# Altium schematic sheet BMS_DAISYCHAIN.SchDoc
size B; Organization: Altium Limited; Address1: L3, 12a Rodborough Rd; Address2: Frenchs Forest; Address3: NSW; Address4: Australia 2086
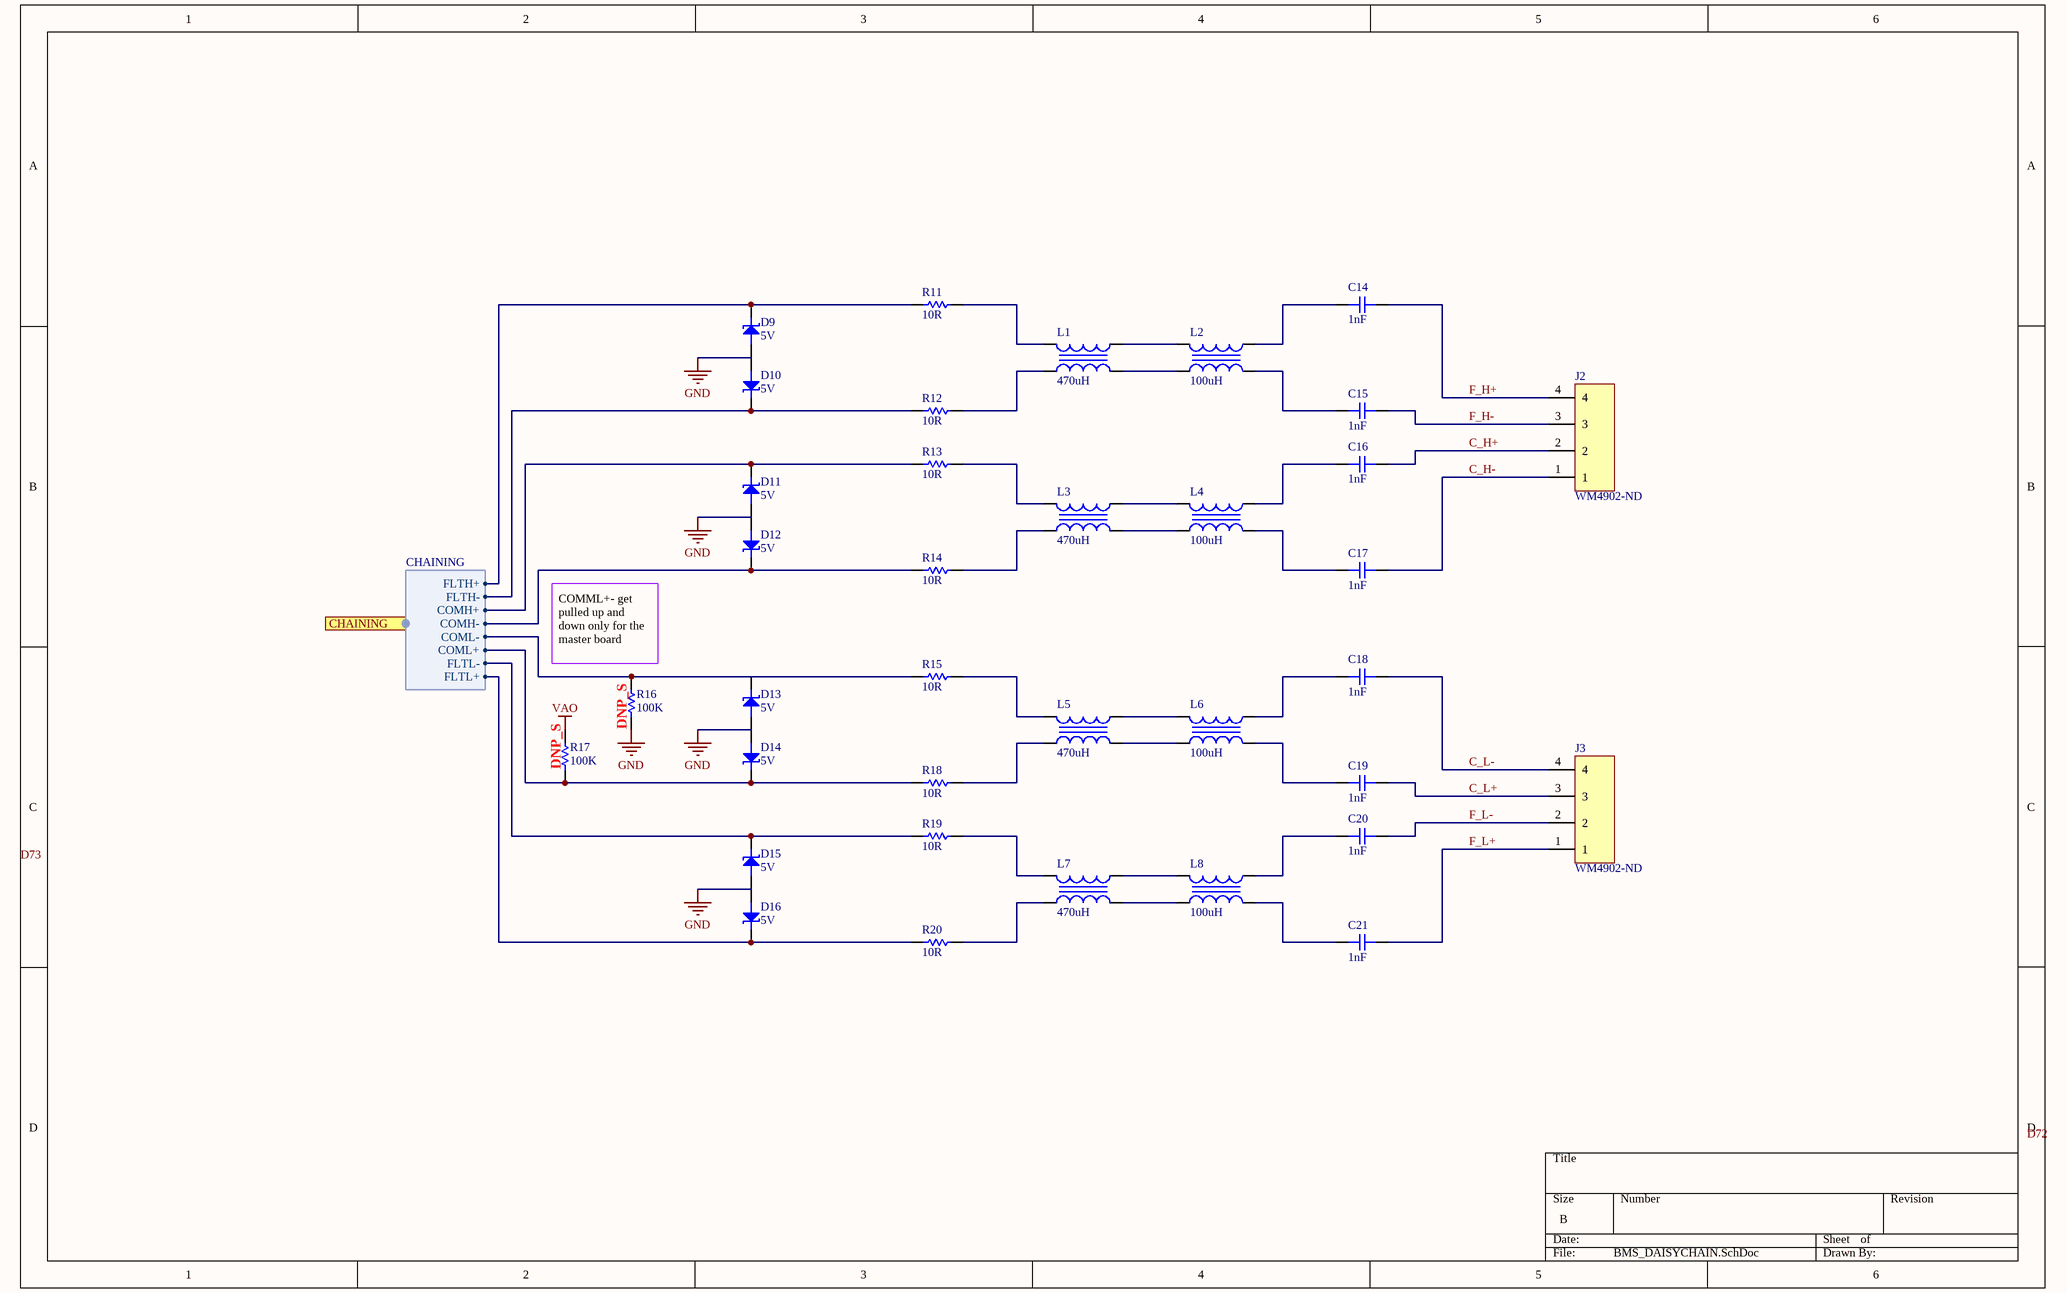
[diagram p0: BMS_DAISYCHAIN.SchDoc]

## Parts
C14  1nF  [CAP-0603]
C15  1nF  [CAP-0603]
C16  1nF  [CAP-0603]
C17  1nF  [CAP-0603]
C18  1nF  [CAP-0603]
C19  1nF  [CAP-0603]
C20  1nF  [CAP-0603]
C21  1nF  [CAP-0603]
D9  5V  [DIODE-SOD323]
D10  5V  [DIODE-SOD323]
D11  5V  [DIODE-SOD323]
D12  5V  [DIODE-SOD323]
D13  5V  [DIODE-SOD323]
D14  5V  [DIODE-SOD323]
D15  5V  [DIODE-SOD323]
D16  5V  [DIODE-SOD323]
J2  WM4902-ND  [4PIN]
J3  WM4902-ND  [4PIN]
L1  470uH  [CMC470u]
L2  100uH  [CMC100U]
L3  470uH  [CMC470u]
L4  100uH  [CMC100U]
L5  470uH  [CMC470u]
L6  100uH  [CMC100U]
L7  470uH  [CMC470u]
L8  100uH  [CMC100U]
R11  10R  [RES-0603]
R12  10R  [RES-0603]
R13  10R  [RES-0603]
R14  10R  [RES-0603]
R15  10R  [RES-0603]
R16  100K  [RES-0603]
R17  100K  [RES-0603]
R18  10R  [RES-0603]
R19  10R  [RES-0603]
R20  10R  [RES-0603]

## Ports
CHAINING (harness CHAINING)

## Harnesses
CHAINING: FLTH+, FLTH-, COMH+, COMH-, COML-, COML+, FLTL-, FLTL+

## Nets
GND: D9.2 D10.2 D11.2 D12.2 D13.2 D14.2 D15.2 D16.2 R16.1
VAO: R17.2
C_H+: C16.2 J2.2
C_H-: C17.2 J2.1
C_L+: C19.2 J3.3
C_L-: C18.2 J3.4
F_H+: C14.2 J2.4
F_H-: C15.2 J2.3
F_L+: C21.2 J3.1
F_L-: C20.2 J3.2
NetC14_1: C14.1 L2.4
NetC15_1: C15.1 L2.3
NetC16_1: C16.1 L4.4
NetC17_1: C17.1 L4.3
NetC18_1: C18.1 L6.4
NetC19_1: C19.1 L6.3
NetC20_1: C20.1 L8.4
NetC21_1: C21.1 L8.3
NetD9_1: D9.1 R11.1 ; port CHAINING.FLTH+
NetD10_1: D10.1 R12.1 ; port CHAINING.FLTH-
NetD11_1: D11.1 R13.1 ; port CHAINING.COMH+
NetD12_1: D12.1 R14.1 ; port CHAINING.COMH-
NetD13_1: D13.1 R15.1 R16.2 ; port CHAINING.COML-
NetD14_1: D14.1 R17.1 R18.1 ; port CHAINING.COML+
NetD15_1: D15.1 R19.1 ; port CHAINING.FLTL-
NetD16_1: D16.1 R20.1 ; port CHAINING.FLTL+
NetL1_1: L1.1 R11.2
NetL1_2: L1.2 R12.2
NetL1_3: L1.3 L2.2
NetL1_4: L1.4 L2.1
NetL3_1: L3.1 R13.2
NetL3_2: L3.2 R14.2
NetL3_3: L3.3 L4.2
NetL3_4: L3.4 L4.1
NetL5_1: L5.1 R15.2
NetL5_2: L5.2 R18.2
NetL5_3: L5.3 L6.2
NetL5_4: L5.4 L6.1
NetL7_1: L7.1 R19.2
NetL7_2: L7.2 R20.2
NetL7_3: L7.3 L8.2
NetL7_4: L7.4 L8.1

## Notes on the sheet
- (near R16) COMML+- get pulled up and down only for the master board
- (near R17) DNP_S
- (near R16) DNP_S
- Labels drawn without touching a wire or pin: D72, D73
- Title
- Size:
- Date:
- Tabloid
- Number:
- Time:
- Revision:
- Sheet
- of
- File:

## Library data of the parts
C14-C21 = 0603-1nF-50V: CAP CER 1000PF 50V X7R 0603; Manufacturer: KEMET; Manufacturer Part Number: C0603C102J5RACTU; Dielectric Material: Ceramic; Tolerance: 5%; Dissipation Factor: 2.5%; Supplier 1: Digi-Key; Stock 1: 378254; Pricing 1: 1=0.1, 10=0.056, 100=0.0248, 500=0.01772, 1000=0.01392 (USD); Mount: Surface Mount; Case/Package: 0603; Number of Pins: 2; Case Code (Imperial): 0603; Case Code (Metric): 1608; Min Operating Temperature: -55°C; Max Operating Temperature: 125°C; Packaging: Tape and Reel; Capacitance: 1nF; Dielectric: X7R; Voltage Rating (DC): 50V; Package Quantity: 1; Voltage Rating: 50V; Termination: SMD/SMT; Length: 1.6mm; Height: 0.8mm; Width: 0.031inch; Depth: 0.8mm; Thickness: 0.034inch; Lead Pitch: 0.7mm; Radiation Hardening: No; REACH SVHC: No SVHC; ComponentLink1URL: http://www.onlinecomponents.com/productFiles/mf-KEM/docfinderpartnumberc0402c102k5ractu.pdf?src-supplier=Onlinecomponents.com; ComponentLink1Description: http://www.onlinecomponents.com/productFiles/mf-KEM/docfinderpartnumberc0402c102k5ractu.pdf?src-supplier=Onlinecomponents.com; Supplier Part Number 1: 399-1083-6-ND
D9-D16 = TVS-5V: TVS DIODE 5V SOD323; Manufacturer: Nexperia; Manufacturer Part Number: PESD5V0U1UA,115; Supplier 1: Digi-Key; Stock 1: 127058; Pricing 1: 1=0.43, 10=0.32, 25=0.28, 100=0.152, 250=0.1512, 500=0.124, 1000=0.092 (USD); ComponentLink1URL: https://assets.nexperia.com/documents/data-sheet/PESD5V0U1UA_UB_UL.pdf?src-supplier=Digi-Key; ComponentLink1Description: https://assets.nexperia.com/documents/data-sheet/PESD5V0U1UA_UB_UL.pdf?src-supplier=Digi-Key; ComponentLink2URL: http://www.farnell.com/datasheets/453996.pdf?src-supplier=Farnell; ComponentLink2Description: http://www.farnell.com/datasheets/453996.pdf?src-supplier=Farnell; Supplier Part Number 1: 1727-4155-6-ND
J2 J3 = 4PIN: CONN HEADER R/A 4POS 2.54MM; Manufacturer: Molex; Manufacturer Part Number: 70553-0003; Number of Positions: 4; Gender: Male; Current Rating: 3A; Voltage Rating: 250V; Contact Resistance: 30mR; Insulation Resistance: 1GR; Approvals: UL,CSA; Glow Wire Compliant: Non-compliant; Supplier 1: Digi-Key; Stock 1: 4238; Pricing 1: 1=1.05, 10=0.927, 100=0.7995, 500=0.65412, 1000=0.58144, 5000=0.50876, 10000=0.48332 (USD); Mount: Through Hole; Color: Black; Housing Color: Black; Housing Material: Polycyclohexylenedimethylene; Contact Material: Bronze,Copper Alloy; Contact Plating: Gold; Material: Brass; Min Operating Temperature: -40°C; Max Operating Temperature: 105°C; Packaging: Rail/Tube; Termination: Through Hole; Number of Rows: 1; Orientation: Right Angle; Package Quantity: 1680; Number of Contacts: 4; Number of Circuits: 4; Voltage Rating (DC): 250V; Pitch: 2.54mm; REACH SVHC: Unknown; ELV: Compliant; Lead Free: Lead Free; Flammability Rating: UL94 V-0; ComponentLink1URL: http://www.molex.com/webdocs/datasheets/pdf/en-us/0705530003_PCB_HEADERS.pdf?src-supplier=Mouser; ComponentLink1Description: http://www.molex.com/webdocs/datasheets/pdf/en-us/0705530003_PCB_HEADERS.pdf?src-supplier=Mouser; ComponentLink2URL: http://www.jameco.com/Jameco/Products/ProdDS/884758.pdf?src-supplier=Jameco; ComponentLink2Description: http://www.jameco.com/Jameco/Products/ProdDS/884758.pdf?src-supplier=Jameco; ComponentLink3URL: http://uk.rs-online.com/webdocs/13c4/0900766b813c4977.pdf?src-supplier=RSComponents; ComponentLink3Description: http://uk.rs-online.com/webdocs/13c4/0900766b813c4977.pdf?src-supplier=RSComponents; Supplier Part Number 1: WM4902-ND
L1 L3 L5 L7 = CMC-470uH: 470µH @ 100kHz 2 Line Common Mode Choke SMD 2.2 kOhms; Manufacturer: Wurth Electronics; Manufacturer Part Number: 744242471; Tolerance: 50%; Number of Lines: 2; Impedance: 2.2kR; Voltage Rating: 80V; Resistance: 350mR; Current Rating: 400mA; Supplier 1: Digi-Key; Stock 1: 424; Pricing 1: 1=3.37, 10=3.125, 50=2.822, 100=2.722, 250=2.52 (USD); Mount: Surface Mount; Case/Package: SMD/SMT; Weight: 0.003351oz; Min Operating Temperature: -40°C; Max Operating Temperature: 125°C; Package Quantity: 1; Packaging: Tape and Reel; Inductance: 470uH; Current: 400mA; DC Resistance (DCR): 350mR; Max DC Current: 400mA; Termination: SMD/SMT; Test Frequency: 100kHz; Length: 0.236inch; Height: 0.138inch; Width: 3.3mm; REACH SVHC: No SVHC; ComponentLink1URL: https://katalog.we-online.de/pbs/datasheet/744242471.pdf?src-supplier=Digi-Key; ComponentLink1Description: https://katalog.we-online.de/pbs/datasheet/744242471.pdf?src-supplier=Digi-Key; ComponentLink2URL: http://www.farnell.com/datasheets/1735656.pdf?src-supplier=Newark; ComponentLink2Description: http://www.farnell.com/datasheets/1735656.pdf?src-supplier=Newark; ComponentLink3URL: https://www.distrelec.biz/Web/Downloads/_t/ds/744242471_eng_tds.pdf?mime=application%2Fpdf&src-supplier=Distrelec; ComponentLink3Description: https://www.distrelec.biz/Web/Downloads/_t/ds/744242471_eng_tds.pdf?mime=application%2Fpdf&src-supplier=Distrelec; ComponentLink4URL: http://www.mouser.com/ds/2/445/744242471-77692.pdf?src-supplier=Mouser; ComponentLink4Description: http://www.mouser.com/ds/2/445/744242471-77692.pdf?src-supplier=Mouser; ComponentLink5URL: http://www.farnell.com/datasheets/1735656.pdf?src-supplier=Element14; ComponentLink5Description: http://www.farnell.com/datasheets/1735656.pdf?src-supplier=Element14; Supplier Part Number 1: 732-1686-6-ND
L2 L4 L6 L8 = CMC-100uH: 100µH @ 100kHz 2 Line Common Mode Choke SMD 5.8 kOhms; Manufacturer: TDK EPCOS; Manufacturer Part Number: B82787C0104H002; Core Material: Ferrite; Tolerance: 50%; DC Resistance (DCR): 2R; DC Current: 150mA; Self Resonant Frequency: 10MHz; Supplier 1: Digi-Key; Stock 1: 6844; Pricing 1: 1=1.62, 10=1.504, 100=1.0878, 500=0.83318, 1000=0.74061 (USD); Case/Package: SMD/SMT; Min Operating Temperature: -40°C; Max Operating Temperature: 150°C; Inductance: 100uH; Packaging: Tape and Reel; Test Frequency: 100kHz; Max DC Current: 150mA; Length: 4.7mm; Height: 2.8mm; Depth: 3.4mm; Lead Free: Lead Free; ComponentLink1URL: http://components.arrow.com/part/dataview/0323_04183589?src-supplier=Arrow+Europe; ComponentLink1Description: http://components.arrow.com/part/dataview/0323_04183589?src-supplier=Arrow+Europe; ComponentLink2URL: https://en.tdk.eu/inf/30/ds/act45b.pdf?src-supplier=Digi-Key; ComponentLink2Description: https://en.tdk.eu/inf/30/ds/act45b.pdf?src-supplier=Digi-Key; Supplier Part Number 1: 495-4598-6-ND
R11-R15 R18-R20 = 0603-10R: RES SMD 10 OHM 1% 1/10W 0603; Manufacturer: Yageo; Manufacturer Part Number: RC0603FR-0710RL; Voltage Rating (DC): 50V; Temperature Coefficient: 200ppm/°C; Power Rating: 100mW; Supplier 1: Digi-Key; Stock 1: 11151092; Pricing 1: 1=0.1, 10=0.046, 100=0.0187, 1000=0.0084, 2500=0.00729 (USD); Case/Package: 0603; Number of Pins: 2; Case Code (Imperial): 0603; Case Code (Metric): 1608; Contact Plating: Tin,Matte; Min Operating Temperature: -55°C; Max Operating Temperature: 155°C; Packaging: Tape and Reel; Resistance: 10R; Tolerance: 1%; Composition: Thick Film; Voltage Rating: 50V; Termination: SMD/SMT; Military Standard: Not; Length: 1.6mm; Height: 0.45mm; Width: 0.8mm; Depth: 0.8mm; Radiation Hardening: No; REACH SVHC: No SVHC; Lead Free: Lead Free; ComponentLink1URL: http://www.farnell.com/datasheets/1868787.pdf?src-supplier=Element14; ComponentLink1Description: http://www.farnell.com/datasheets/1868787.pdf?src-supplier=Element14; ComponentLink2URL: http://www.yageo.com/documents/recent/PYu-RC0603_51_RoHS_L_4.pdf?src-supplier=Avnet; ComponentLink2Description: http://www.yageo.com/documents/recent/PYu-RC0603_51_RoHS_L_4.pdf?src-supplier=Avnet; ComponentLink3URL: http://documents.rs-components.com/techlib://itc_doclist_GB.htm?stockno=5048984&src-supplier=RSComponents; ComponentLink3Description: http://documents.rs-components.com/techlib://itc_doclist_GB.htm?stockno=5048984&src-supplier=RSComponents; ComponentLink4URL: http://www.yageo.com/documents/recent/PYu-RC0603_51_RoHS_L_4.pdf?src-supplier=Avnet+Europe; ComponentLink4Description: http://www.yageo.com/documents/recent/PYu-RC0603_51_RoHS_L_4.pdf?src-supplier=Avnet+Europe; Supplier Part Number 1: 311-10.0HRDKR-ND
R16 R17 = 0603-100KR: RES 100K OHM 1% 1/10W 0603; Manufacturer: Stackpole Electronics; Manufacturer Part Number: RMCF0603FT100K; Resistance: 100kR; Power Rating: 100mW; Temperature Coefficient: 100ppm/°C; Working Voltage: 75V; Supplier 1: Digi-Key; Stock 1: 1428218; Pricing 1: 1=0.1, 10=0.016, 100=0.0065, 1000=0.00292, 2500=0.00253 (USD); Mount: Surface Mount; Case/Package: 0603; Case Code (Metric): 1608; Case Code (Imperial): 0603; Contact Plating: Tin,Matte; Min Operating Temperature: -55°C; Max Operating Temperature: 155°C; Packaging: Tape and Reel; Tolerance: 1%; Composition: Thick Film; Number of Terminations: 2; Military Standard: Not; Max Power Dissipation: 100mW; Features: Automotive AEC-Q200; Length: 1.55mm; Height: 0.022inch; Width: 0.031inch; Depth: 0.8mm; Radiation Hardening: No; Lead Free: Lead Free; ComponentLink1URL: https://www.verical.com/server-webapp/html/getDatasheet?partID=362597&src-supplier=Verical; ComponentLink1Description: https://www.verical.com/server-webapp/html/getDatasheet?partID=362597&src-supplier=Verical; Supplier Part Number 1: RMCF0603FT100KDKR-ND